# EAGLE design ArduinoNano33Proto-V3.0 (EAGLE 7.4.0)
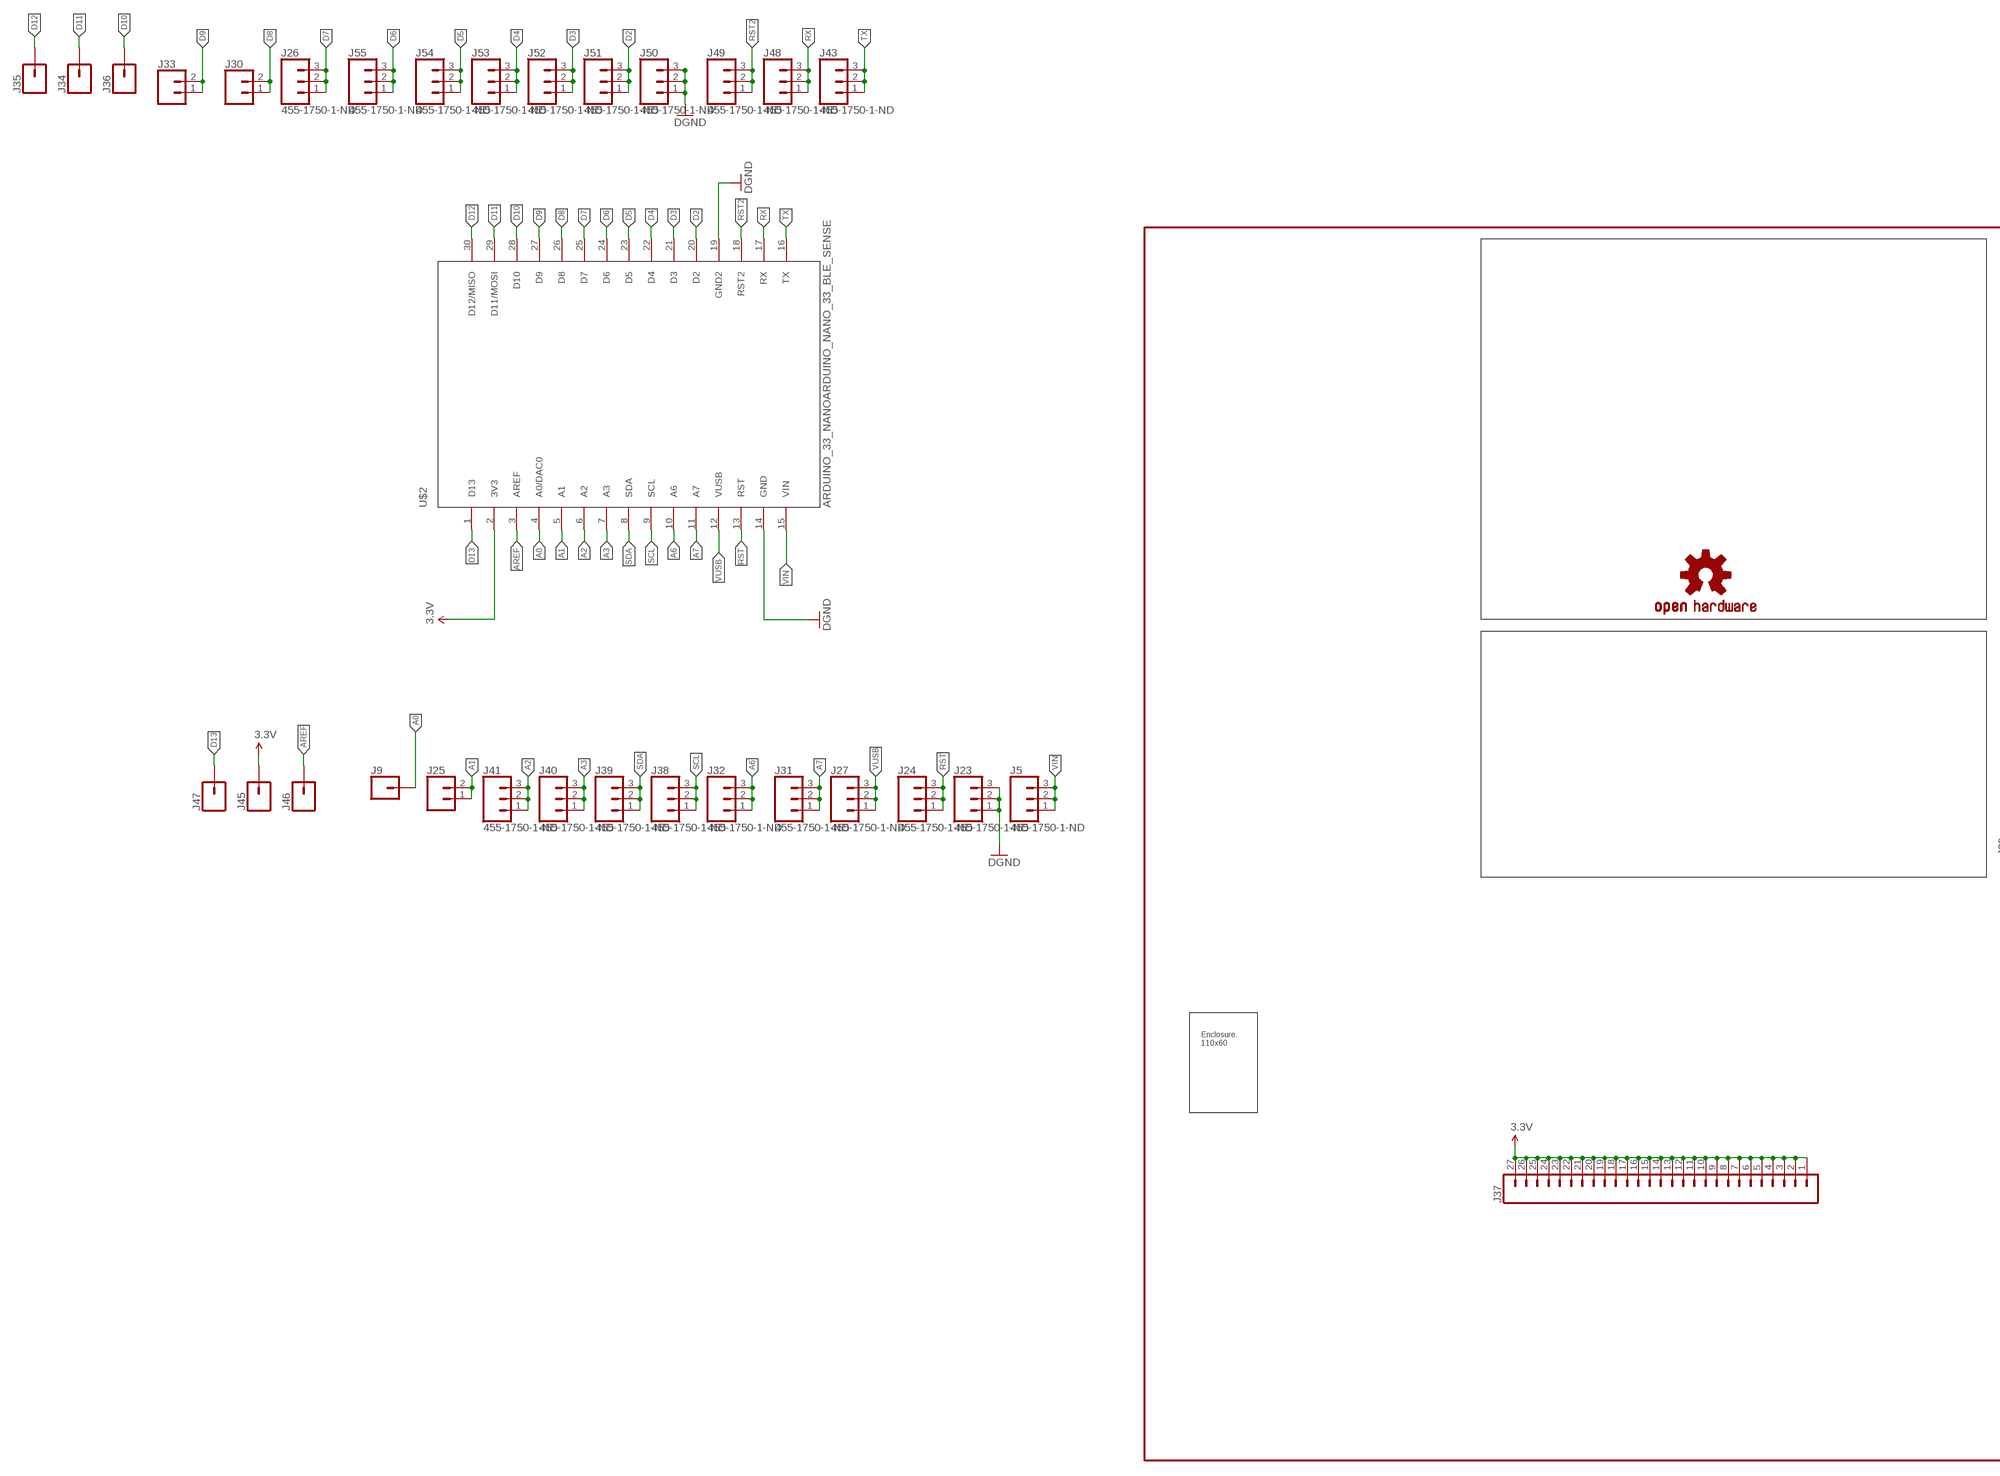
[diagram p0: schematic, sheet 1, part 1 of 2]
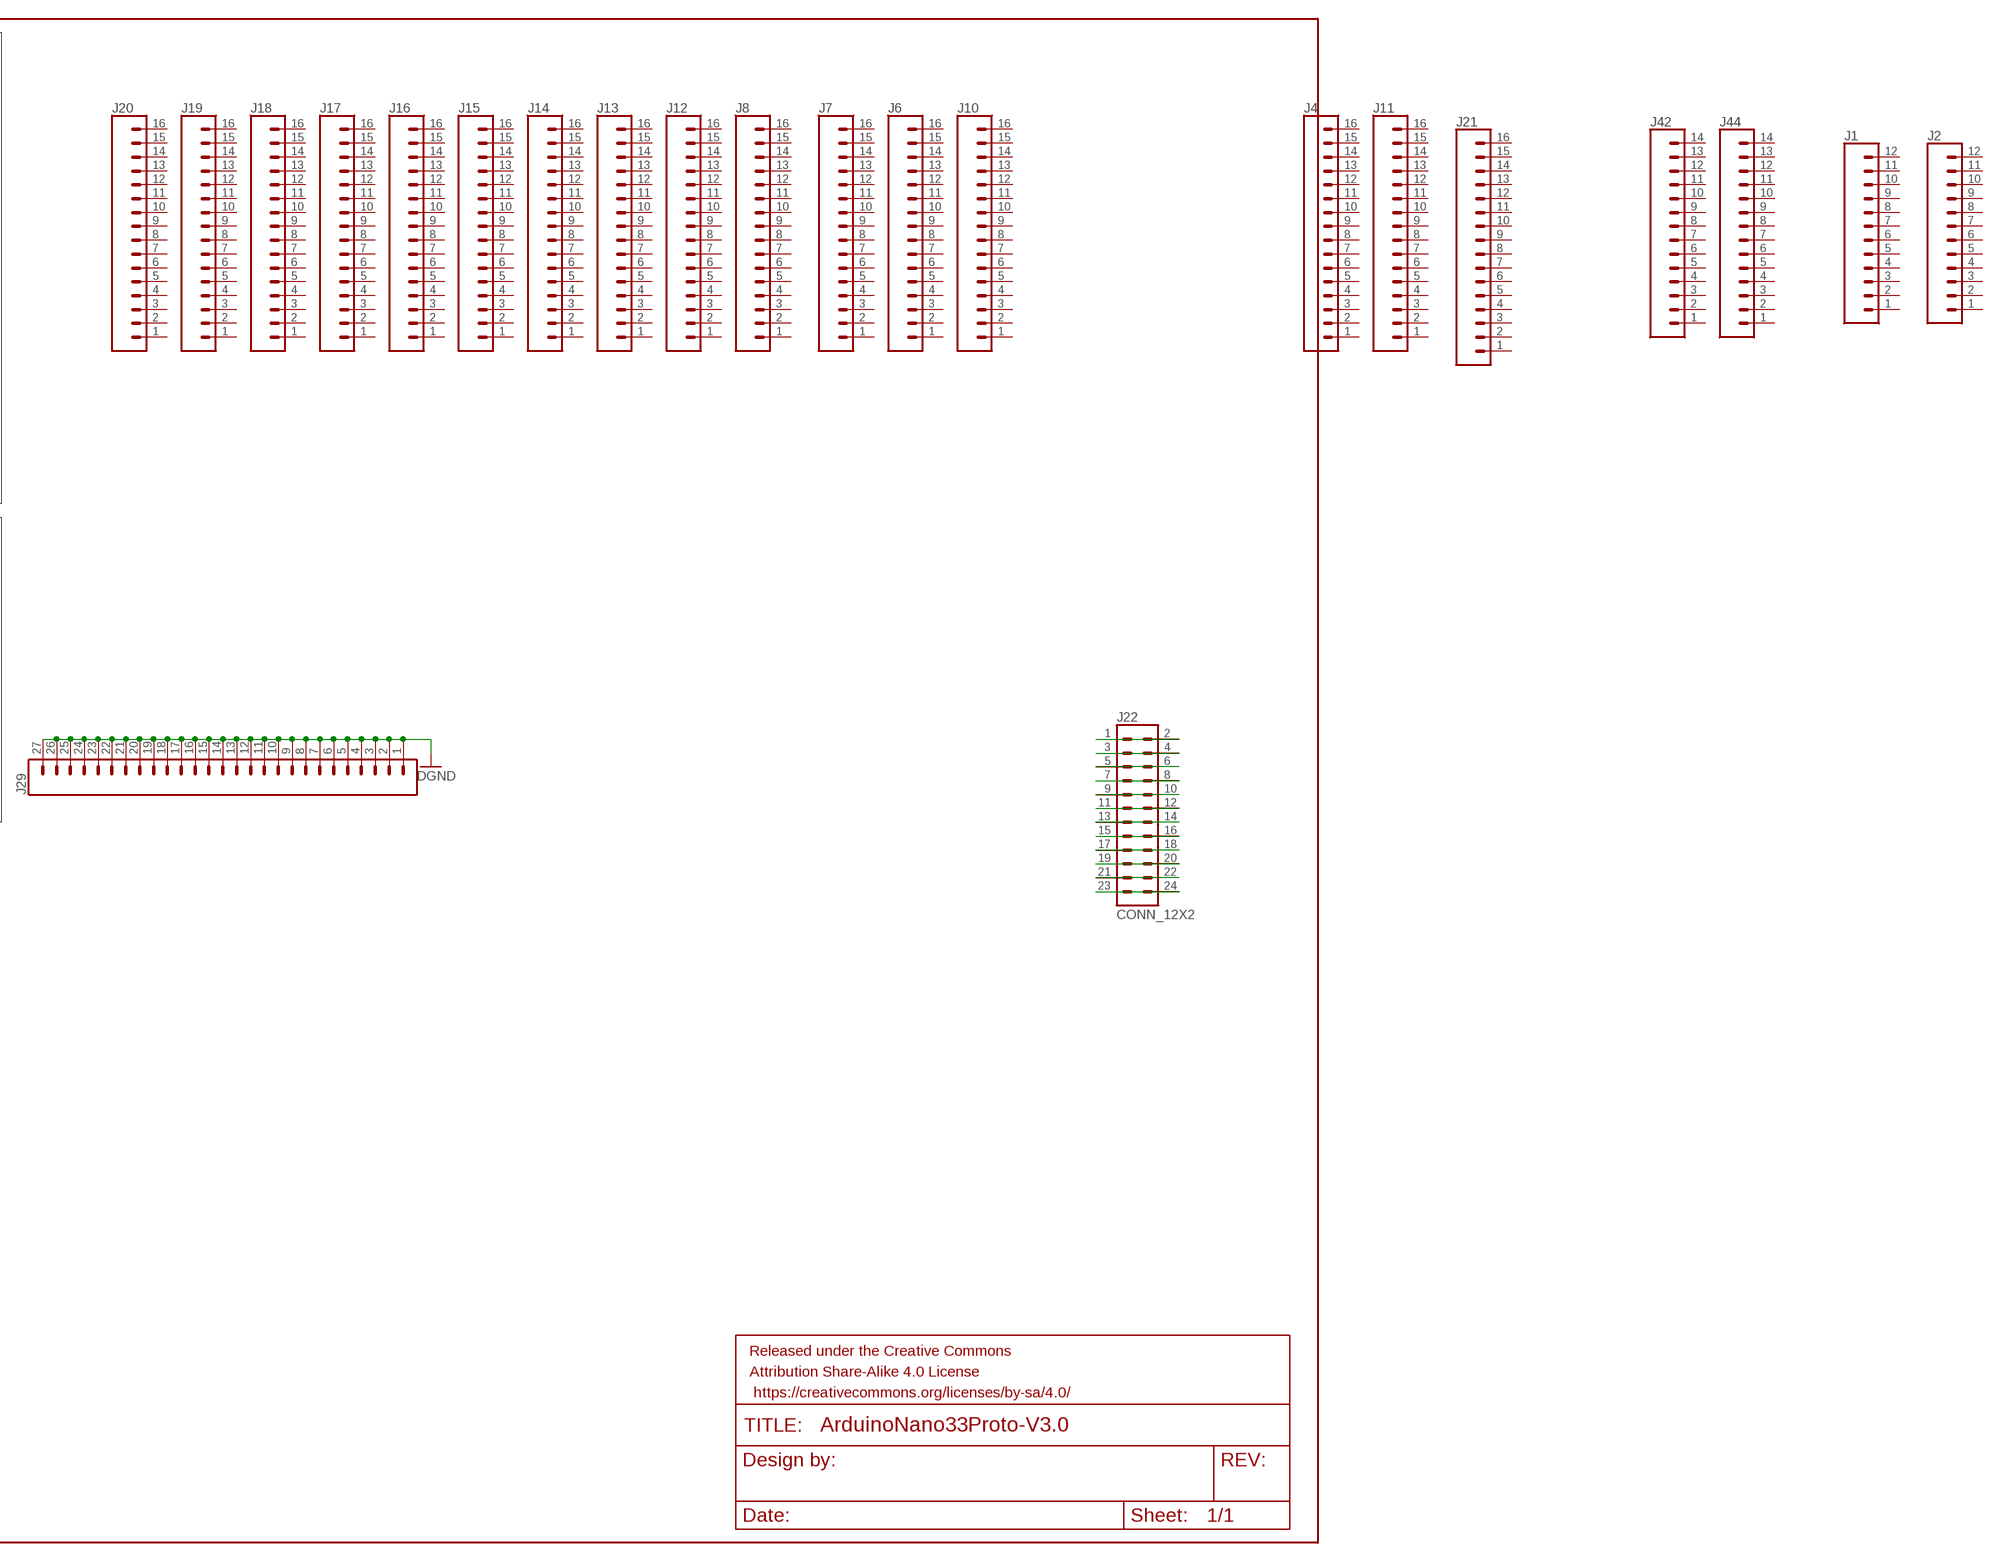
[diagram p1: schematic, sheet 1, part 2 of 2]

## Parts
FRAME2  FRAME-LEDGER  [CREATIVE_COMMONS]
J1  CONN_12NO_SILK  [1X12_NO_SILK]
J2  CONN_12NO_SILK  [1X12_NO_SILK]
J4  CONN_161X16_NO_SILK  [1X16_NO_SILK]
J5  455-1750-1-ND  CONN_03  [1X03]
J6  CONN_161X16_NO_SILK  [1X16_NO_SILK]
J7  CONN_161X16_NO_SILK  [1X16_NO_SILK]
J8  CONN_161X16_NO_SILK  [1X16_NO_SILK]
J9  CONN_01PTH_NO_SILK_YES_STOP  [1X01_NO_SILK]
J10  CONN_161X16_NO_SILK  [1X16_NO_SILK]
J11  CONN_161X16_NO_SILK  [1X16_NO_SILK]
J12  CONN_161X16_NO_SILK  [1X16_NO_SILK]
J13  CONN_161X16_NO_SILK  [1X16_NO_SILK]
J14  CONN_161X16_NO_SILK  [1X16_NO_SILK]
J15  CONN_161X16_NO_SILK  [1X16_NO_SILK]
J16  CONN_161X16_NO_SILK  [1X16_NO_SILK]
J17  CONN_161X16_NO_SILK  [1X16_NO_SILK]
J18  CONN_161X16_NO_SILK  [1X16_NO_SILK]
J19  CONN_161X16_NO_SILK  [1X16_NO_SILK]
J20  CONN_161X16_NO_SILK  [1X16_NO_SILK]
J21  CONN_161X16_NO_SILK  [1X16_NO_SILK]
J22  CONN_12X2  [2X12]
J23  455-1750-1-ND  CONN_03  [1X03]
J24  455-1750-1-ND  CONN_03  [1X03]
J25  CONN_02  [1X02]
J26  455-1750-1-ND  CONN_03  [1X03]
J27  455-1750-1-ND  CONN_03  [1X03]
J29  CONN_27  [1X27]
J30  CONN_02  [1X02]
J31  455-1750-1-ND  CONN_03  [1X03]
J32  455-1750-1-ND  CONN_03  [1X03]
J33  CONN_02  [1X02]
J34  CONN_01PTH_NO_SILK_YES_STOP  [1X01_NO_SILK]
J35  CONN_01PTH_NO_SILK_YES_STOP  [1X01_NO_SILK]
J36  CONN_01PTH_NO_SILK_YES_STOP  [1X01_NO_SILK]
J37  CONN_27  [1X27]
J38  455-1750-1-ND  CONN_03  [1X03]
J39  455-1750-1-ND  CONN_03  [1X03]
J40  455-1750-1-ND  CONN_03  [1X03]
J41  455-1750-1-ND  CONN_03  [1X03]
J42  CONN_14NO_SILK  [1X14_NO_SILK]
J43  455-1750-1-ND  CONN_03  [1X03]
J44  CONN_14NO_SILK  [1X14_NO_SILK]
J45  CONN_01PTH_NO_SILK_YES_STOP  [1X01_NO_SILK]
J46  CONN_01PTH_NO_SILK_YES_STOP  [1X01_NO_SILK]
J47  CONN_01PTH_NO_SILK_YES_STOP  [1X01_NO_SILK]
J48  455-1750-1-ND  CONN_03  [1X03]
J49  455-1750-1-ND  CONN_03  [1X03]
J50  455-1750-1-ND  CONN_03  [1X03]
J51  455-1750-1-ND  CONN_03  [1X03]
J52  455-1750-1-ND  CONN_03  [1X03]
J53  455-1750-1-ND  CONN_03  [1X03]
J54  455-1750-1-ND  CONN_03  [1X03]
J55  455-1750-1-ND  CONN_03  [1X03]
LOGO1  OSHW-LOGOM  [OSHW-LOGO-M]
U$1  CAMDENBOSS-ENCLOSURE-110X60BOTH-EXTENDED-WIDE  [CAMDENBOSS_ENCLOSURE_110X60_WIDE_EXTENDED]
U$2  ARDUINO_33_NANOARDUINO_NANO_33_BLE_SENSE  [ARDUINO_NANO_33]

## Nets
3.3V: J37.1 J37.2 J37.3 J37.4 J37.5 J37.6 J37.7 J37.8 J37.9 J37.10 J37.11 J37.12 J37.13 J37.14 J37.15 J37.16 J37.17 J37.18 J37.19 J37.20 J37.21 J37.22 J37.23 J37.24 J37.25 J37.26 J37.27 J45.1 U$2.2(3V3)
A0: J9.1 U$2.4(A0/DAC0)
A1: J25.1 J25.2 U$2.5(A1)
A2: J41.1 J41.2 J41.3 U$2.6(A2)
A3: J40.1 J40.2 J40.3 U$2.7(A3)
A6: J32.1 J32.2 J32.3 U$2.10(A6)
A7: J31.1 J31.2 J31.3 U$2.11(A7)
AREF: J46.1 U$2.3(AREF)
D2: J51.1 J51.2 J51.3 U$2.20(D2)
D3: J52.1 J52.2 J52.3 U$2.21(D3)
D4: J53.1 J53.2 J53.3 U$2.22(D4)
D5: J54.1 J54.2 J54.3 U$2.23(D5)
D6: J55.1 J55.2 J55.3 U$2.24(D6)
D7: J26.1 J26.2 J26.3 U$2.25(D7)
D8: J30.1 J30.2 U$2.26(D8)
D9: J33.1 J33.2 U$2.27(D9)
D10: J36.1 U$2.28(D10)
D11: J34.1 U$2.29(D11/MOSI)
D12: J35.1 U$2.30(D12/MISO)
D13: J47.1 U$2.1(D13)
GND: J23.1 J23.2 J23.3 J29.1 J29.2 J29.3 J29.4 J29.5 J29.6 J29.7 J29.8 J29.9 J29.10 J29.11 J29.12 J29.13 J29.14 J29.15 J29.16 J29.17 J29.18 J29.19 J29.20 J29.21 J29.22 J29.23 J29.24 J29.25 J29.26 J29.27 J50.1 J50.2 J50.3 U$2.14(GND) U$2.19(GND2) ; supply symbol labelled DGND
N$1: J22.1 J22.2
N$3: J22.3 J22.4
N$4: J22.5 J22.6
N$6: J22.7 J22.8
N$7: J22.9 J22.10
N$11: J22.11 J22.12
N$12: J22.13 J22.14
N$13: J22.15 J22.16
N$15: J22.17 J22.18
N$16: J22.19 J22.20
N$19: J22.21 J22.22
N$20: J22.23 J22.24
RST: J24.1 J24.2 J24.3 U$2.13(RST)
RST2: J49.1 J49.2 J49.3 U$2.18(RST2)
RX: J48.1 J48.2 J48.3 U$2.17(RX)
SCL: J38.1 J38.2 J38.3 U$2.9(SCL)
SDA: J39.1 J39.2 J39.3 U$2.8(SDA)
TX: J43.1 J43.2 J43.3 U$2.16(TX)
VIN: J5.1 J5.2 J5.3 U$2.15(VIN)
VUSB: J27.1 J27.2 J27.3 U$2.12(VUSB)
Unconnected: J1.1 J1.2 J1.3 J1.4 J1.5 J1.6 J1.7 J1.8 J1.9 J1.10 J1.11 J1.12 J2.1 J2.2 J2.3 J2.4 J2.5 J2.6 J2.7 J2.8 J2.9 J2.10 J2.11 J2.12 J4.1 J4.2 J4.3 J4.4 J4.5 J4.6 J4.7 J4.8 J4.9 J4.10 J4.11 J4.12 J4.13 J4.14 J4.15 J4.16 J6.1 J6.2 J6.3 J6.4 J6.5 J6.6 J6.7 J6.8 J6.9 J6.10 J6.11 J6.12 J6.13 J6.14 J6.15 J6.16 J7.1 J7.2 J7.3 J7.4 J7.5 J7.6 J7.7 J7.8 J7.9 J7.10 J7.11 J7.12 J7.13 J7.14 J7.15 J7.16 J8.1 J8.2 J8.3 J8.4 J8.5 J8.6 J8.7 J8.8 J8.9 J8.10 J8.11 J8.12 J8.13 J8.14 J8.15 J8.16 J10.1 J10.2 J10.3 J10.4 J10.5 J10.6 J10.7 J10.8 J10.9 J10.10 J10.11 J10.12 J10.13 J10.14 J10.15 J10.16 J11.1 J11.2 J11.3 J11.4 J11.5 J11.6 J11.7 J11.8 J11.9 J11.10 J11.11 J11.12 J11.13 J11.14 J11.15 J11.16 J12.1 J12.2 J12.3 J12.4 J12.5 J12.6 J12.7 J12.8 J12.9 J12.10 J12.11 J12.12 J12.13 J12.14 J12.15 J12.16 J13.1 J13.2 J13.3 J13.4 J13.5 J13.6 J13.7 J13.8 J13.9 J13.10 J13.11 J13.12 J13.13 J13.14 J13.15 J13.16 J14.1 J14.2 J14.3 J14.4 J14.5 J14.6 J14.7 J14.8 J14.9 J14.10 J14.11 J14.12 J14.13 J14.14 J14.15 J14.16 J15.1 J15.2 J15.3 J15.4 J15.5 J15.6 J15.7 J15.8 J15.9 J15.10 J15.11 J15.12 J15.13 J15.14 J15.15 J15.16 J16.1 J16.2 J16.3 J16.4 J16.5 J16.6 J16.7 J16.8 J16.9 J16.10 J16.11 J16.12 J16.13 J16.14 J16.15 J16.16 J17.1 J17.2 J17.3 J17.4 J17.5 J17.6 J17.7 J17.8 J17.9 J17.10 J17.11 J17.12 J17.13 J17.14 J17.15 J17.16 J18.1 J18.2 J18.3 J18.4 J18.5 J18.6 J18.7 J18.8 J18.9 J18.10 J18.11 J18.12 J18.13 J18.14 J18.15 J18.16 J19.1 J19.2 J19.3 J19.4 J19.5 J19.6 J19.7 J19.8 J19.9 J19.10 J19.11 J19.12 J19.13 J19.14 J19.15 J19.16 J20.1 J20.2 J20.3 J20.4 J20.5 J20.6 J20.7 J20.8 J20.9 J20.10 J20.11 J20.12 J20.13 J20.14 J20.15 J20.16 J21.1 J21.2 J21.3 J21.4 J21.5 J21.6 J21.7 J21.8 J21.9 J21.10 J21.11 J21.12 J21.13 J21.14 J21.15 J21.16 J42.1 J42.2 J42.3 J42.4 J42.5 J42.6 J42.7 J42.8 J42.9 J42.10 J42.11 J42.12 J42.13 J42.14 J44.1 J44.2 J44.3 J44.4 J44.5 J44.6 J44.7 J44.8 J44.9 J44.10 J44.11 J44.12 J44.13 J44.14

## Library data of the parts
FRAME2 = SparkFun-Aesthetics:FRAME-LEDGER: Schematic Frame Standard 11x14 US Ledger frame
J1 J2 = SparkFun-Connectors:CONN_12: Multi connection point. Often used as Generic Header-pin footprint for 0.1 inch spaced/style header connections On any of the 0.1 inch spaced packages, you can populate with these: Break Away Headers - Straight <https://www.sparkfun.com/products/116> (PRT-00116) Break Away Male Headers - Right Angle <https://www.sparkfun.com/products/553> (PRT-00553) Female Headers <https://www.sparkfun.com/products/115> (PRT-00115) Break Away Headers - Machine Pin <https://www.sparkfun.com/products/117> (PRT-00117) Break Away Female Headers - Swiss Machine Pin <https://www.sparkfun.com/products/743> (PRT-00743) For SCREWTERMINALS and SPRING TERMINALS visit here: Screw Terimnals on SparkFun.com <https://www.sparkfun.com/search/results?term=Screw+Terminals> (5mm/3.5mm/2.54mm spacing) This device is also useful as a general connection point to wire up your design to another part of your project. Our various solder wires solder well into these plated through hole pads. Hook-Up Wire - Assortment (Stranded, 22 AWG) <https://www.sparkfun.com/products/11375> (PRT-11375) Hook-Up Wire - Assortment (Solid Core, 22 AWG) <https://www.sparkfun.com/products/11367> (PRT-11367) View the entire wire category on our website here <https://www.sparkfun.com/categories/141> Special notes: Molex polarized connector foot print use with SKU : PRT-08231 with associated crimp pins and housings. 1MM SMD Version SKU: PRT-10208 NOTES ON THE VARIANTS LOCK and LOCK_LONGPADS... This footprint was designed to help hold the alignment of a through-hole component (i.e. 6-pin header) while soldering it into place. You may notice that each hole has been shifted either up or down by 0.005 of an inch from it's more standard position (which is a perfectly straight line). This slight alteration caused the pins (the squares in the middle) to touch the edges of the holes. Because they are alternating, it causes a "brace" to hold the component in place. 0.005 has proven to be the perfect amount of "off-center" position when using our standard breakaway headers. Although looks a little odd when you look at the bare footprint, once you have a header in there, the alteration is very hard to notice. Also,if you push a header all the way into place, it is covered up entirely on the bottom side.
J4 J6-J8 J10-J21 = SparkFun-Connectors:CONN_16: Multi connection point. Often used as Generic Header-pin footprint for 0.1 inch spaced/style header connections On any of the 0.1 inch spaced packages, you can populate with these: Break Away Headers - Straight <https://www.sparkfun.com/products/116> (PRT-00116) Break Away Male Headers - Right Angle <https://www.sparkfun.com/products/553> (PRT-00553) Female Headers <https://www.sparkfun.com/products/115> (PRT-00115) Break Away Headers - Machine Pin <https://www.sparkfun.com/products/117> (PRT-00117) Break Away Female Headers - Swiss Machine Pin <https://www.sparkfun.com/products/743> (PRT-00743) For SCREWTERMINALS and SPRING TERMINALS visit here: Screw Terimnals on SparkFun.com <https://www.sparkfun.com/search/results?term=Screw+Terminals> (5mm/3.5mm/2.54mm spacing) This device is also useful as a general connection point to wire up your design to another part of your project. Our various solder wires solder well into these plated through hole pads. Hook-Up Wire - Assortment (Stranded, 22 AWG) <https://www.sparkfun.com/products/11375> (PRT-11375) Hook-Up Wire - Assortment (Solid Core, 22 AWG) <https://www.sparkfun.com/products/11367> (PRT-11367) View the entire wire category on our website here <https://www.sparkfun.com/categories/141> Special notes: Molex polarized connector foot print use with SKU : PRT-08231 with associated crimp pins and housings. 1MM SMD Version SKU: PRT-10208 NOTES ON THE VARIANTS LOCK and LOCK_LONGPADS... This footprint was designed to help hold the alignment of a through-hole component (i.e. 6-pin header) while soldering it into place. You may notice that each hole has been shifted either up or down by 0.005 of an inch from it's more standard position (which is a perfectly straight line). This slight alteration caused the pins (the squares in the middle) to touch the edges of the holes. Because they are alternating, it causes a "brace" to hold the component in place. 0.005 has proven to be the perfect amount of "off-center" position when using our standard breakaway headers. Although looks a little odd when you look at the bare footprint, once you have a header in there, the alteration is very hard to notice. Also,if you push a header all the way into place, it is covered up entirely on the bottom side.
J5 J23 J24 J26 J27 J31 J32 J38-J41 J43 J48-J55 = SparkFun-Connectors:CONN_03: Multi connection point. Often used as Generic Header-pin footprint for 0.1 inch spaced/style header connections On any of the 0.1 inch spaced packages, you can populate with these: Break Away Headers - Straight <https://www.sparkfun.com/products/116> (PRT-00116) Break Away Male Headers - Right Angle <https://www.sparkfun.com/products/553> (PRT-00553) Female Headers <https://www.sparkfun.com/products/115> (PRT-00115) Break Away Headers - Machine Pin <https://www.sparkfun.com/products/117> (PRT-00117) Break Away Female Headers - Swiss Machine Pin <https://www.sparkfun.com/products/743> (PRT-00743) Stackable Header - 3 Pin (Female, 0.1") <https://www.sparkfun.com/products/13875> (PRT-13875) For SCREWTERMINALS and SPRING TERMINALS visit here: Screw Terimnals on SparkFun.com <https://www.sparkfun.com/search/results?term=Screw+Terminals> (5mm/3.5mm/2.54mm spacing) This device is also useful as a general connection point to wire up your design to another part of your project. Our various solder wires solder well into these plated through hole pads. Hook-Up Wire - Assortment (Stranded, 22 AWG) <https://www.sparkfun.com/products/11375> (PRT-11375) Hook-Up Wire - Assortment (Solid Core, 22 AWG) <https://www.sparkfun.com/products/11367> (PRT-11367) View the entire wire category on our website here <https://www.sparkfun.com/categories/141> Special notes: Molex polarized connector foot print use with SKU : PRT-08232 with associated crimp pins and housings.; PROD_ID: XXX-00000
J9 J34-J36 J45-J47 = SparkFun-Connectors:CONN_01: Single connection point. Often used as Generic Header-pin footprint for 0.1 inch spaced/style header connections On any of the 0.1 inch spaced packages, you can populate with these: Break Away Headers - Straight <https://www.sparkfun.com/products/116> (PRT-00116) Break Away Male Headers - Right Angle <https://www.sparkfun.com/products/553> (PRT-00553) Female Headers <https://www.sparkfun.com/products/115> (PRT-00115) Break Away Headers - Machine Pin <https://www.sparkfun.com/products/117> (PRT-00117) Break Away Female Headers - Swiss Machine Pin <https://www.sparkfun.com/products/743> (PRT-00743) This device is also useful as a general connection point to wire up your design to another part of your project. Our various solder wires solder well into these plated through hole pads. Hook-Up Wire - Assortment (Stranded, 22 AWG) <https://www.sparkfun.com/products/11375> (PRT-11375) Hook-Up Wire - Assortment (Solid Core, 22 AWG) <https://www.sparkfun.com/products/11367> (PRT-11367) View the entire wire category on our website here <https://www.sparkfun.com/categories/141> Special notes: SMTSO-256-ET is a "flush mount" nut for a 4-40 screw. We mostly use this on specialty testbeds; it is a nice way to connect hardware to your PCB at an adjustable hieght. Also note, the SNAP packages are for using a snappable style connector. We sell a baggie of snaps and they are also used on two LilyPad designs: Snap Assortment - 30 pack (male and female) <https://www.sparkfun.com/products/11347> (DEV-11347) LilyPad Arduino SimpleSnap <https://www.sparkfun.com/products/10941> (DEV-10941) LilyPad SimpleSnap Protoboard <https://www.sparkfun.com/products/10940> (DEV-10940)
J22 = SparkFun-Connectors:CONN_12X2: Multi connection point. Often used as Generic Header-pin footprint for 0.1 inch spaced/style header connections On any of the 0.1 inch spaced packages, you can populate with these: Break Away Headers - Straight <https://www.sparkfun.com/products/116> (PRT-00116) Break Away Male Headers - Right Angle <https://www.sparkfun.com/products/553> (PRT-00553) Female Headers <https://www.sparkfun.com/products/115> (PRT-00115) Break Away Headers - Machine Pin <https://www.sparkfun.com/products/117> (PRT-00117) Break Away Female Headers - Swiss Machine Pin <https://www.sparkfun.com/products/743> (PRT-00743)
J25 J30 J33 = SparkFun-Connectors:CONN_02: Multi connection point. Often used as Generic Header-pin footprint for 0.1 inch spaced/style header connections On any of the 0.1 inch spaced packages, you can populate with these: Break Away Headers - Straight <https://www.sparkfun.com/products/116> (PRT-00116) Break Away Male Headers - Right Angle <https://www.sparkfun.com/products/553> (PRT-00553) Female Headers <https://www.sparkfun.com/products/115> (PRT-00115) Break Away Headers - Machine Pin <https://www.sparkfun.com/products/117> (PRT-00117) Break Away Female Headers - Swiss Machine Pin <https://www.sparkfun.com/products/743> (PRT-00743) For SCREWTERMINALS and SPRING TERMINALS visit here: Screw Terimnals on SparkFun.com <https://www.sparkfun.com/search/results?term=Screw+Terminals> (5mm/3.5mm/2.54mm spacing) This device is also useful as a general connection point to wire up your design to another part of your project. Our various solder wires solder well into these plated through hole pads. Hook-Up Wire - Assortment (Stranded, 22 AWG) <https://www.sparkfun.com/products/11375> (PRT-11375) Hook-Up Wire - Assortment (Solid Core, 22 AWG) <https://www.sparkfun.com/products/11367> (PRT-11367) View the entire wire category on our website here <https://www.sparkfun.com/categories/141> Special notes: Molex polarized connector foot print use with: PRT-08233 with associated crimp pins and housings. 2.54_SCREWTERM for use with PRT-10571. 3.5mm Screw Terminal footprints for PRT-08084 5mm Screw Terminal footprints for use with PRT-08432
J29 J37 = SparkFun-Connectors:CONN_27: Multi connection point. Often used as Generic Header-pin footprint for 0.1 inch spaced/style header connections On any of the 0.1 inch spaced packages, you can populate with these: Break Away Headers - Straight <https://www.sparkfun.com/products/116> (PRT-00116) Break Away Male Headers - Right Angle <https://www.sparkfun.com/products/553> (PRT-00553) Female Headers <https://www.sparkfun.com/products/115> (PRT-00115) Break Away Headers - Machine Pin <https://www.sparkfun.com/products/117> (PRT-00117) Break Away Female Headers - Swiss Machine Pin <https://www.sparkfun.com/products/743> (PRT-00743) For SCREWTERMINALS and SPRING TERMINALS visit here: Screw Terimnals on SparkFun.com <https://www.sparkfun.com/search/results?term=Screw+Terminals> (5mm/3.5mm/2.54mm spacing) This device is also useful as a general connection point to wire up your design to another part of your project. Our various solder wires solder well into these plated through hole pads. Hook-Up Wire - Assortment (Stranded, 22 AWG) <https://www.sparkfun.com/products/11375> (PRT-11375) Hook-Up Wire - Assortment (Solid Core, 22 AWG) <https://www.sparkfun.com/products/11367> (PRT-11367) View the entire wire category on our website here <https://www.sparkfun.com/categories/141> Special notes: Molex polarized connector foot print use with SKU : PRT-08231 with associated crimp pins and housings. 1MM SMD Version SKU: PRT-10208 NOTES ON THE VARIANTS LOCK and LOCK_LONGPADS... This footprint was designed to help hold the alignment of a through-hole component (i.e. 6-pin header) while soldering it into place. You may notice that each hole has been shifted either up or down by 0.005 of an inch from it's more standard position (which is a perfectly straight line). This slight alteration caused the pins (the squares in the middle) to touch the edges of the holes. Because they are alternating, it causes a "brace" to hold the component in place. 0.005 has proven to be the perfect amount of "off-center" position when using our standard breakaway headers. Although looks a little odd when you look at the bare footprint, once you have a header in there, the alteration is very hard to notice. Also,if you push a header all the way into place, it is covered up entirely on the bottom side.
J42 J44 = SparkFun-Connectors:CONN_14: Multi connection point. Often used as Generic Header-pin footprint for 0.1 inch spaced/style header connections On any of the 0.1 inch spaced packages, you can populate with these: Break Away Headers - Straight <https://www.sparkfun.com/products/116> (PRT-00116) Break Away Male Headers - Right Angle <https://www.sparkfun.com/products/553> (PRT-00553) Female Headers <https://www.sparkfun.com/products/115> (PRT-00115) Break Away Headers - Machine Pin <https://www.sparkfun.com/products/117> (PRT-00117) Break Away Female Headers - Swiss Machine Pin <https://www.sparkfun.com/products/743> (PRT-00743) For SCREWTERMINALS and SPRING TERMINALS visit here: Screw Terimnals on SparkFun.com <https://www.sparkfun.com/search/results?term=Screw+Terminals> (5mm/3.5mm/2.54mm spacing) This device is also useful as a general connection point to wire up your design to another part of your project. Our various solder wires solder well into these plated through hole pads. Hook-Up Wire - Assortment (Stranded, 22 AWG) <https://www.sparkfun.com/products/11375> (PRT-11375) Hook-Up Wire - Assortment (Solid Core, 22 AWG) <https://www.sparkfun.com/products/11367> (PRT-11367) View the entire wire category on our website here <https://www.sparkfun.com/categories/141> Special notes: Molex polarized connector foot print use with SKU : PRT-08231 with associated crimp pins and housings. 1MM SMD Version SKU: PRT-10208 NOTES ON THE VARIANTS LOCK and LOCK_LONGPADS... This footprint was designed to help hold the alignment of a through-hole component (i.e. 6-pin header) while soldering it into place. You may notice that each hole has been shifted either up or down by 0.005 of an inch from it's more standard position (which is a perfectly straight line). This slight alteration caused the pins (the squares in the middle) to touch the edges of the holes. Because they are alternating, it causes a "brace" to hold the component in place. 0.005 has proven to be the perfect amount of "off-center" position when using our standard breakaway headers. Although looks a little odd when you look at the bare footprint, once you have a header in there, the alteration is very hard to notice. Also,if you push a header all the way into place, it is covered up entirely on the bottom side.
LOGO1 = SparkFun-Aesthetics:OSHW-LOGO: Open Source Hardware Logo This logo indicates the piece of hardware it is found on incorporates a OSHW license and/or adheres to the definition of open source hardware found here: http://freedomdefined.org/OSHW
U$1 = ThingySticks:CAMDENBOSS-ENCLOSURE-110X60: CamdenBoss Enclosure MFG: CSACTT002 Farnell: 2392777
U$2 = ThingySticks:ARDUINO_33_NANO: https://store.arduino.cc/nano-33-iot

## Board
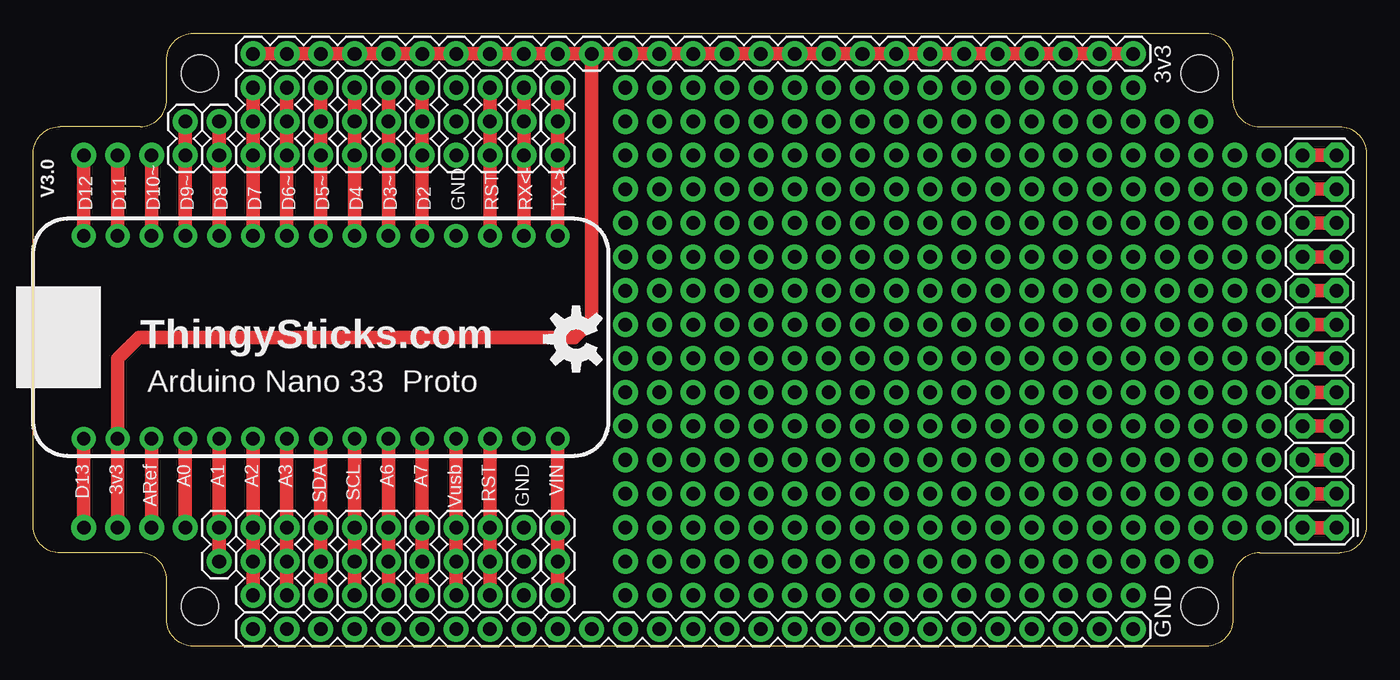
[diagram p2: board, top side]
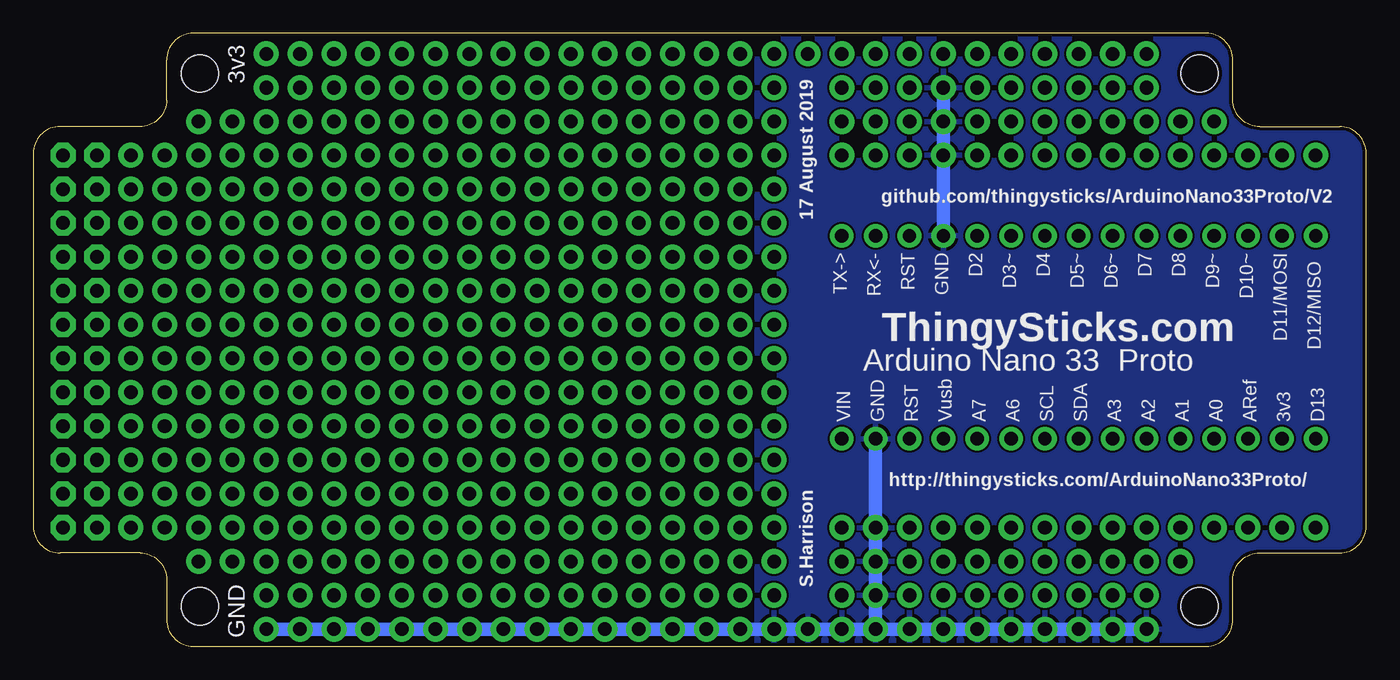
[diagram p3: board, bottom side, seen from below]

Size 100 x 46 mm. Coordinates in mm from the lower left corner, seen from the top.
Copper layers (1*16): Top 0.035mm / dielectric 1.5mm / Bottom 0.035mm
Design rules "dirt_cheap_dirty_boards.v1.1": minimum track width 6mil, minimum drill 12mil, track to track 6mil, track to pad 6mil, pad to pad 6mil, via to via 6mil, smd to smd 0mil, copper to edge 10mil, drill to drill 10mil, minimum pad ring 10mil, minimum via ring 6mil, stop-mask expansion 2mil, vias tented up to drill 25mil, thermal gap 10mil
tRestrict: area 10.5,41 to 14.5,45; area 10.5,1 to 14.5,5; area 85.5,1 to 89.5,5; area 85.5,41 to 89.5,45

### Footprints (pad centres in the part's own frame; a part is rotated, then mirrored left to right if it is on the bottom)
1X12_NO_SILK = drill 1.016 pad 1.88: 1 0,0; 2 2.54,0; 3 5.08,0; 4 7.62,0; 5 10.16,0; 6 12.7,0; 7 15.24,0; 8 17.78,0; 9 20.32,0; 10 22.86,0; 11 25.4,0; 12 27.94,0
1X16_NO_SILK = drill 1.016 pad 1.88: 1 0,0; 2 2.54,0; 3 5.08,0; 4 7.62,0; 5 10.16,0; 6 12.7,0; 7 15.24,0; 8 17.78,0; 9 20.32,0; 10 22.86,0; 11 25.4,0; 12 27.94,0; 13 30.48,0; 14 33.02,0; 15 35.56,0; 16 38.1,0
1X03 = drill 1.016 pad 1.88: 1 0,0; 2 2.54,0; 3 5.08,0
1X01_NO_SILK = drill 1.016 pad 1.88: 1 0,0
2X12 = drill 1.016 pad 1.88 octagon: 1 0,0; 2 0,2.54; 3 2.54,0; 4 2.54,2.54; 5 5.08,0; 6 5.08,2.54; 7 7.62,0; 8 7.62,2.54; 9 10.16,0; 10 10.16,2.54; 11 12.7,0; 12 12.7,2.54; 13 15.24,0; 14 15.24,2.54; 15 17.78,0; 16 17.78,2.54; 17 20.32,0; 18 20.32,2.54; 19 22.86,0; 20 22.86,2.54; 21 25.4,0; 22 25.4,2.54; 23 27.94,0; 24 27.94,2.54
1X02 = drill 1.016 pad 1.88: 1 0,0; 2 2.54,0
1X27 = drill 1.016 pad 1.88: 1 0,0; 2 2.54,0; 3 5.08,0; 4 7.62,0; 5 10.16,0; 6 12.7,0; 7 15.24,0; 8 17.78,0; 9 20.32,0; 10 22.86,0; 11 25.4,0; 12 27.94,0; 13 30.48,0; 14 33.02,0; 15 35.56,0; 16 38.1,0; 17 40.64,0; 18 43.18,0; 19 45.72,0; 20 48.26,0; 21 50.8,0; 22 53.34,0; 23 55.88,0; 24 58.42,0; 25 60.96,0; 26 63.5,0; 27 66.04,0
1X14_NO_SILK = drill 1.016 pad 1.88: 1 0,0; 2 2.54,0; 3 5.08,0; 4 7.62,0; 5 10.16,0; 6 12.7,0; 7 15.24,0; 8 17.78,0; 9 20.32,0; 10 22.86,0; 11 25.4,0; 12 27.94,0; 13 30.48,0; 14 33.02,0
CAMDENBOSS_ENCLOSURE_110X60_WIDE_EXTENDED = hole 2.8: 43,2.5; 43,77.5; 3,77.5; 3,2.5
ARDUINO_NANO_33 = drill 1 pad 1.778: 1 1.27,-3.81; 2 1.27,-6.35; 3 1.27,-8.89; 4 1.27,-11.43; 5 1.27,-13.97; 6 1.27,-16.51; 7 1.27,-19.05; 8 1.27,-21.59; 9 1.27,-24.13; 10 1.27,-26.67; 11 1.27,-29.21; 12 1.27,-31.75; 13 1.27,-34.29; 14 1.27,-36.83; 15 1.27,-39.37; 16 16.51,-39.37; 17 16.51,-36.83; 18 16.51,-34.29; 19 16.51,-31.75; 20 16.51,-29.21; 21 16.51,-26.67; 22 16.51,-24.13; 23 16.51,-21.59; 24 16.51,-19.05; 25 16.51,-16.51; 26 16.51,-13.97; 27 16.51,-11.43; 28 16.51,-8.89; 29 16.51,-6.35; 30 16.51,-3.81

### Placement (x,y rotation side)
FRAME2  16.52,-14.12 0 top  (outside the outline)
J1  92.68,36.84 270 top
J2  90.14,36.84 270 top
J4  82.52,41.92 270 top
J5  39.34,3.82 90 top
J6  72.36,41.92 270 top
J7  69.82,41.92 270 top
J8  74.91,41.92 270 top
J9  11.4,8.9 0 top
J10  44.42,41.92 270 top
J11  79.98,41.92 270 top
J12  67.28,41.92 270 top
J13  64.74,41.92 270 top
J14  62.2,41.92 270 top
J15  59.66,41.92 270 top
J16  57.12,41.92 270 top
J17  54.58,41.92 270 top
J18  52.04,41.92 270 top
J19  49.5,41.92 270 top
J20  46.96,41.92 270 top
J21  77.44,41.92 270 top
J22  97.77,8.9 90 top
J23  36.8,3.82 90 top
J24  34.26,3.82 90 top
J25  13.94,6.36 90 top
J26  16.48,36.84 90 top
J27  31.72,3.82 90 top
J29  16.48,1.28 0 top
J30  13.94,36.84 90 top
J31  29.18,3.82 90 top
J32  26.64,3.82 90 top
J33  11.4,36.84 90 top
J34  6.32,36.84 0 top
J35  3.78,36.84 0 top
J36  8.86,36.84 0 top
J37  16.48,44.46 0 top
J38  24.1,3.82 90 top
J39  21.56,3.82 90 top
J40  19.02,3.82 90 top
J41  16.48,3.82 90 top
J42  87.6,39.38 270 top
J43  39.34,36.84 90 top
J44  85.06,39.38 270 top
J45  6.32,8.9 0 top
J46  8.86,8.9 0 top
J47  3.78,8.9 0 top
J48  36.8,36.84 90 top
J49  34.26,36.84 90 top
J50  31.72,36.84 90 top
J51  29.18,36.84 90 top
J52  26.64,36.84 90 top
J53  24.1,36.84 90 top
J54  21.56,36.84 90 top
J55  19.02,36.84 90 top
LOGO1  40.73,23.05 90 top
U$1  90,0 90 top
U$2  -0.03,14.3 90 top

### Tracks (layer width: path | path; a pad name or v marks a point on that pad's centre or on a via)
3.3V
  Top 1.016: J37.1 J37.2 J37.3 J37.4 J37.5 J37.6 J37.7 J37.8 J37.9 J37.10 J37.11 | J37.11 J37.12 J37.13 J37.14 J37.15 J37.16 J37.17 J37.18 J37.19 J37.20 J37.21 J37.22 J37.23 J37.24 J37.25 J37.26 J37.27 | J45.1 U$2.2 6.32,21.6 7.91,23.19 40.61,23.19 41.88,24.46 J37.11
A0
  Top 1.016: U$2.4 J9.1
A1
  Top 1.016: J25.1 J25.2 U$2.5
A2
  Top 1.016: U$2.6 J41.3 J41.2 J41.1
A3
  Top 1.016: J40.1 J40.2 J40.3 U$2.7
A6
  Top 1.016: J32.1 J32.2 J32.3 U$2.10
A7
  Top 1.016: U$2.11 J31.3 J31.2 J31.1
AREF
  Top 1.016: J46.1 U$2.3
D2
  Top 1.016: U$2.20 J51.1 J51.2 J51.3
D3
  Top 1.016: J52.3 J52.2 J52.1 U$2.21
D4
  Top 1.016: U$2.22 J53.1 J53.2 J53.3
D5
  Top 1.016: J54.3 J54.2 J54.1 U$2.23
D6
  Top 1.016: J55.3 J55.2 J55.1 U$2.24
D7
  Top 1.016: J26.3 J26.2 J26.1 U$2.25
D8
  Top 1.016: U$2.26 J30.1 J30.2
D9
  Top 1.016: U$2.27 J33.1 J33.2
D10
  Top 1.016: U$2.28 J36.1
D11
  Top 1.016: U$2.29 J34.1
D12
  Top 1.016: U$2.30 J35.1
D13
  Top 1.016: J47.1 U$2.1
GND
  Bottom 1.016: J29.1 J29.2 J29.3 J29.4 J29.5 J29.6 J29.7 J29.8 J29.9 | J29.9 J29.10 J29.11 J29.12 J29.13 J29.14 J29.15 J29.16 J29.17 J29.18 J29.19 J29.20 J29.21 J29.22 J29.23 J29.24 J29.25 J29.26 J29.27 | J29.9 J23.1 J23.2 J23.3 U$2.14 | J50.3 J50.2 J50.1 U$2.19
  pour Bottom: -0.34,46.68 45.69,46.68 45.69,-0.62 -0.34,-0.62
N$1
  Top 1.016: J22.1 J22.2
N$3
  Top 1.016: J22.4 J22.3
N$4
  Top 1.016: J22.5 J22.6
N$6
  Top 1.016: J22.8 J22.7
N$7
  Top 1.016: J22.9 J22.10
N$11
  Top 1.016: J22.12 J22.11
N$12
  Top 1.016: J22.14 J22.13
N$13
  Top 1.016: J22.15 J22.16
N$15
  Top 1.016: J22.18 J22.17
N$16
  Top 1.016: J22.19 J22.20
N$19
  Top 1.016: J22.22 J22.21
N$20
  Top 1.016: J22.23 J22.24
RST
  Top 1.016: U$2.13 J24.3 J24.2 J24.1
RST2
  Top 1.016: U$2.18 J49.1 J49.2 J49.3
RX
  Top 1.016: J48.3 J48.2 J48.1 U$2.17
SCL
  Top 1.016: U$2.9 J38.3 J38.2 J38.1
SDA
  Top 1.016: U$2.8 J39.3 J39.2 | 21.25,6.04 J39.2 | J39.2 J39.1
TX
  Top 1.016: U$2.16 J43.1 J43.2 J43.3
VIN
  Top 1.016: J5.1 J5.2 J5.3 U$2.15
VUSB
  Top 1.016: J27.1 J27.2 J27.3 U$2.12

### Text on the board
tNames: 3v3 | V3.0 | ThingySticks.com | Arduino Nano 33 Proto | GND
bNames: 17 August 2019 | 3v3 | github.com/thingysticks/ArduinoNano33Proto/V2 | ThingySticks.com | Arduino Nano 33 Proto | http://thingysticks.com/ArduinoNano33Proto/ | S.Harrison | GND